# Altium schematic sheet Overview.SchDoc
size A; SheetNumber: 1; SheetTotal: 3
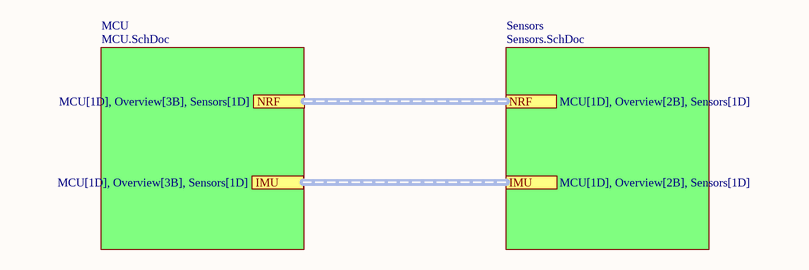
[diagram p0: Overview.SchDoc]

## Sub-sheets
MCU = MCU.SchDoc: no entries
Sensors = Sensors.SchDoc: no entries

## Ports
IMU (harness IMU, see MCU[1D], Overview[2B], Sensors[1D]), IMU (harness IMU, see MCU[1D], Overview[3B], Sensors[1D]), NRF (harness NRF, see MCU[1D], Overview[2B], Sensors[1D]), NRF (harness NRF, see MCU[1D], Overview[3B], Sensors[1D])